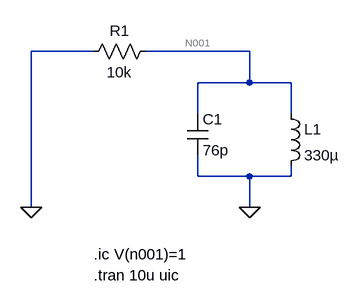
[diagram p0: schematic circuito-R-L-C transitorio.asc]
circuito-R-L-C transitorio.asc, the LTspice schematic file:
Version 4
SHEET 1 880 680
WIRE 144 0 48 0
WIRE 384 0 224 0
WIRE 384 48 384 0
WIRE 384 48 304 48
WIRE 448 48 384 48
WIRE 304 96 304 48
WIRE 448 96 448 48
WIRE 304 192 304 160
WIRE 384 192 304 192
WIRE 448 192 448 176
WIRE 448 192 384 192
WIRE 48 240 48 0
WIRE 384 240 384 192
FLAG 384 240 0
FLAG 48 240 0
SYMBOL cap 288 96 R0
SYMATTR InstName C1
SYMATTR Value 76p
SYMBOL ind 432 80 R0
SYMATTR InstName L1
SYMATTR Value 330µ
SYMATTR SpiceLine Rser=5
SYMBOL res 240 -16 R90
WINDOW 0 0 56 VBottom 2
WINDOW 3 32 56 VTop 2
SYMATTR InstName R1
SYMATTR Value 10k
TEXT 144 344 Left 2 !.tran 10u uic
TEXT 144 312 Left 2 !.ic V(n001)=1

The netlist it stands for:
* circuito-R-L-C transitorio.asc
C1 N001 0 76p
L1 N001 0 330µ Rser=5
R1 N001 0 10k
.tran 10u uic
.ic V(n001)=1
.backanno
.end